# Altium schematic sheet PMIC.SchDoc: sparkfun-battery-babysitter
size 274 x 210 mm; Date: 9/29/2018 7:12:57 PM; SheetNumber: 1
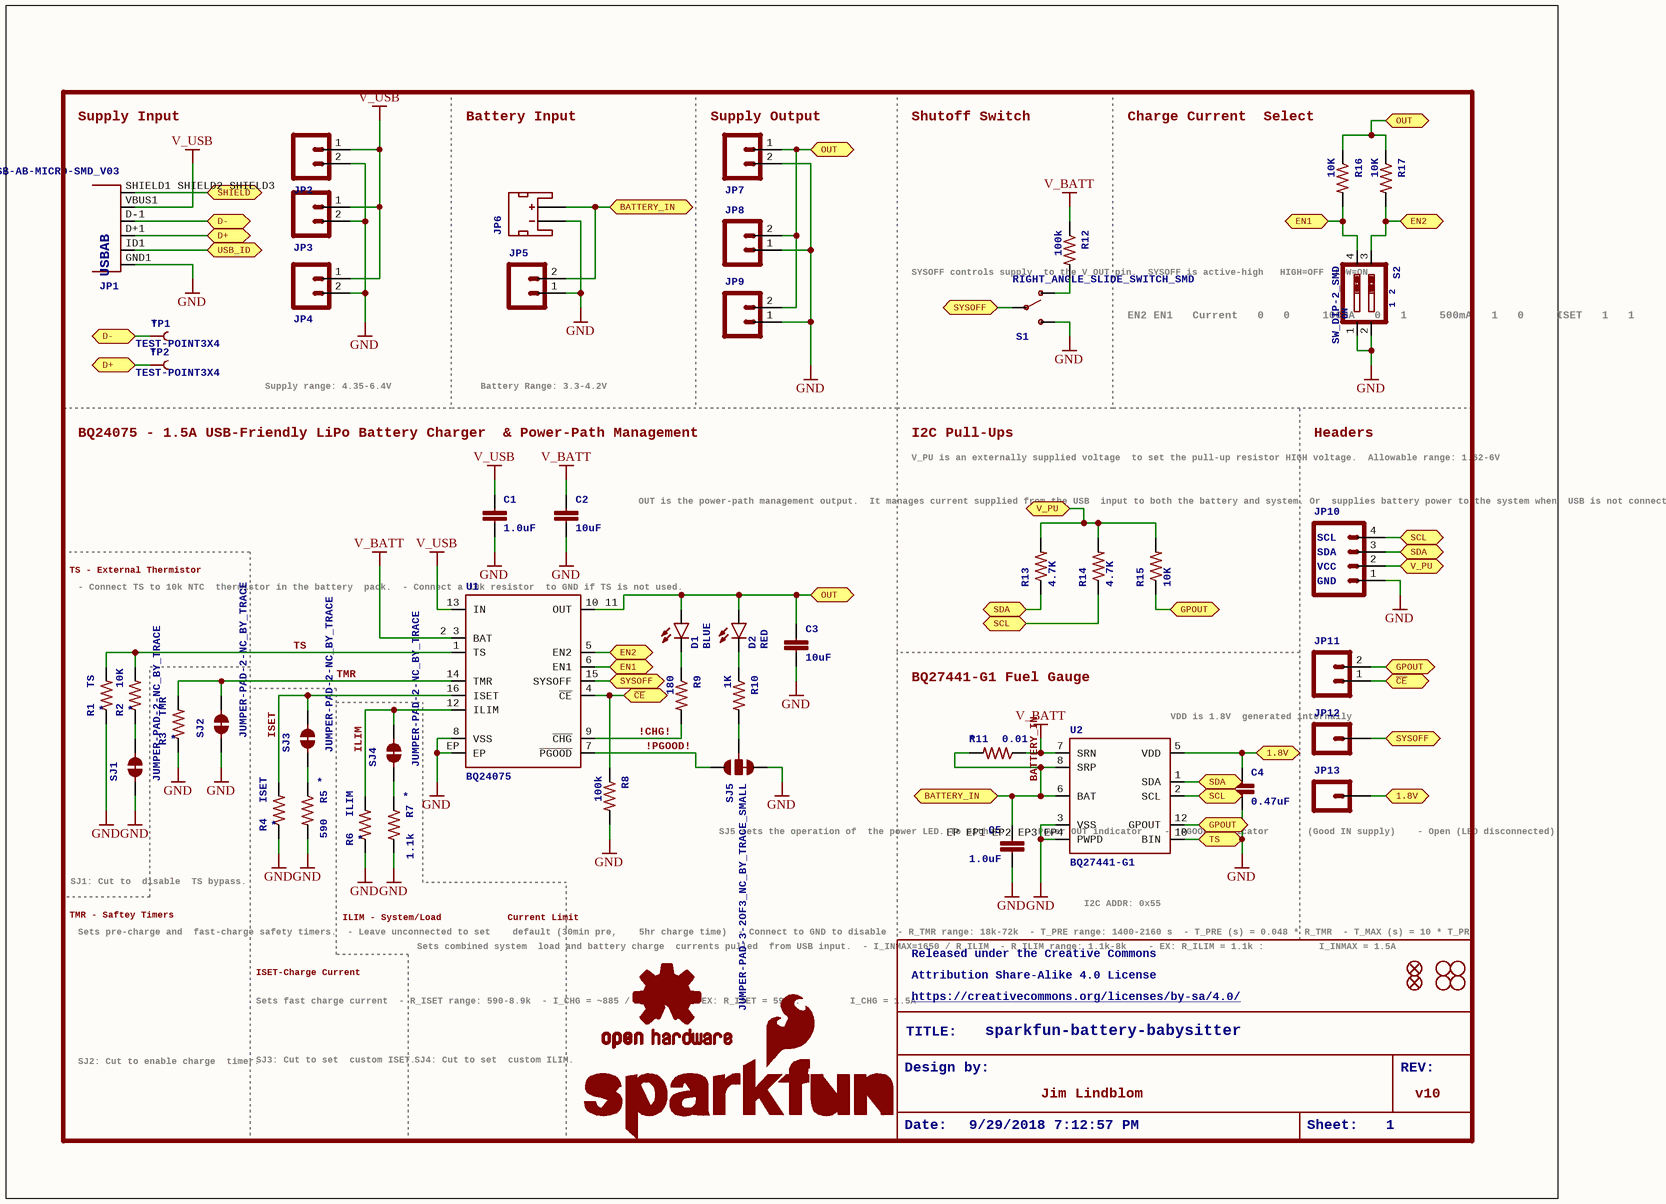
[diagram p0: PMIC.SchDoc]

## Parts
C1  1.0uF  [1206-CAP]
C2  10uF  [0805-CAP]
C3  10uF  [0805-CAP]
C4  0.47uF  [0603-CAP]
C5  1.0uF  [0603-CAP]
D1  BLUE  [LED-0603]
D2  RED  [LED-0603]
FID1  FIDUCIAL1X2  [FIDUCIAL-1X2]  (value not drawn)
FID2  FIDUCIAL1X2  [FIDUCIAL-1X2]  (value not drawn)
JP1  USB-AB-MICRO-SMD_V03  [USB-AB-MICRO-SMD_V03]
JP2  M021X02_NO_SILK  [1X02_NO_SILK]  (value not drawn)
JP3  M023.5MM-NO_SILK  [SCREWTERMINAL-3.5MM-2-NS]  (value not drawn)
JP4  M021X02_NO_SILK  [1X02_NO_SILK]  (value not drawn)
JP5  M021X02_NO_SILK  [1X02_NO_SILK]  (value not drawn)
JP6  JST_2MM_MALE  [JST-2-SMD]  (value not drawn)
JP7  M023.5MM-NO_SILK  [SCREWTERMINAL-3.5MM-2-NS]  (value not drawn)
JP8  M021X02_NO_SILK  [1X02_NO_SILK]  (value not drawn)
JP9  M02-JST-2-PTH-NO_SILK  [JST-2-PTH-NS]  (value not drawn)
JP10  I2C_STANDARD_NO_SILK  [1X04_NO_SILK]  (value not drawn)
JP11  M021X02_NO_SILK  [1X02_NO_SILK]  (value not drawn)
JP12  M01PTH_NO_SILK_YES_STOP  [1X01_NO_SILK]  (value not drawn)
JP13  M01PTH_NO_SILK_YES_STOP  [1X01_NO_SILK]  (value not drawn)
LOGO1  SFE_LOGO_NAME.1_INCH  [SFE_LOGO_NAME_.1]  (value not drawn)
LOGO2  SFE_LOGO_NAME_FLAME.1_INCH  [SFE_LOGO_NAME_FLAME_.1]  (value not drawn)
LOGO3  OSHW-LOGOS  [OSHW-LOGO-S]  (value not drawn)
R1  TS  [1/6W-RES]
R2  10K  [0603-RES]
R3  TMR  [1/6W-RES]
R4  ISET  [1/6W-RES]
R5  590  [0603-RES]
R6  ILIM  [1/6W-RES]
R7  1.1k  [0603-RES]
R8  100k  [0603-RES]
R9  180  [0603-RES]
R10  1K  [0603-RES]
R11  0.01  [1206]
R12  100k  [0603-RES]
R13  4.7K  [0603-RES]
R14  4.7K  [0603-RES]
R15  10K  [0603-RES]
R16  10K  [0603-RES]
R17  10K  [0603-RES]
S1  RIGHT_ANGLE_SLIDE_SWITCH_SMD  [SWITCH-SPST-SMD-A]
S2  SW_DIP-2_SMD  [DIPSWITCH-02-50MIL]
SJ1  JUMPER-PAD-2-NC_BY_TRACE  [PAD-JUMPER-2-NC_BY_TRACE_YES_SILK]
SJ2  JUMPER-PAD-2-NC_BY_TRACE  [PAD-JUMPER-2-NC_BY_TRACE_YES_SILK]
SJ3  JUMPER-PAD-2-NC_BY_TRACE  [PAD-JUMPER-2-NC_BY_TRACE_YES_SILK]
SJ4  JUMPER-PAD-2-NC_BY_TRACE  [PAD-JUMPER-2-NC_BY_TRACE_YES_SILK]
SJ5  JUMPER-PAD-3-2OF3_NC_BY_TRACE_SMALL  [PAD-JUMPER-3-2OF3_NC_BY_TRACE_YES_SILK_FULL_BOX]
STANDOFF1  STAND-OFF  [STAND-OFF]  (value not drawn)
STANDOFF2  STAND-OFF  [STAND-OFF]  (value not drawn)
STANDOFF3  STAND-OFF  [STAND-OFF]  (value not drawn)
STANDOFF4  STAND-OFF  [STAND-OFF]  (value not drawn)
TP1  TEST-POINT3X4  [PAD.03X.04]
TP2  TEST-POINT3X4  [PAD.03X.04]
U1  BQ24075  [PVQFN-N16]
U2  BQ27441-G1  [PDSO-N12]

## Ports
1.8V, BATTERY_IN, D+, D-, EN1, EN2, GPOUT, OUT, SCL, SDA, SHIELD, SYSOFF, TS, USB_ID, V_PU, ~{CE}

## Nets
GND: C1.2 C2.2 C3.2 C4.2 C5.2 JP1.GND1(GND) JP2.2 JP3.2 JP4.2 JP5.1 JP6.1(-) JP7.2 JP8.1 JP9.1 JP10.1 R1.1 R3.1 R4.1 R5.2 R6.1 R7.2 R8.2 S1.3(S) S2.1 S2.2 SJ1.1 SJ2.1 SJ5.3 U1.8(VSS) U1.EP U2.3(VSS) U2.10(BIN) U2.EP_EP1_EP2_EP3_EP4(PWPD) ; port TS
V_BATT: C2.1 R11.1 R12.1 U1.2_3(BAT) U2.7(SRN)
V_USB: C1.1 JP1.VBUS1(VBUS) JP2.1 JP3.1 JP4.1 U1.13(IN)
1.8V: C4.1 JP13.1 U2.5(VDD) ; port 1.8V
!CHG!: R9.2 U1.9(~{CHG})
!PGOOD!: SJ5.1 U1.7(~{PGOOD})
BATTERY_IN: C5.1 JP5.2 JP6.2(+) R11.2 U2.6(BAT) U2.8(SRP) ; port BATTERY_IN
~{CE}: JP11.1 R8.1 U1.4(~{CE}) ; port ~{CE}
D+: JP1.D+1(D+) TP2.P$1 ; port D+
D-: JP1.D-1(D-) TP1.P$1 ; port D-
EN1: R16.2 S2.4 U1.6(EN1) ; port EN1
EN2: R17.2 S2.3 U1.5(EN2) ; port EN2
GPOUT: JP11.2 R15.1 U2.12(GPOUT) ; port GPOUT
ILIM: R6.2 SJ4.2 U1.12(ILIM)
ISET: R4.2 SJ3.2 U1.16(ISET)
OUT: C3.1 D1.A D2.A JP7.1 JP8.2 JP9.2 R16.1 R17.1 U1.10_11(OUT) ; port OUT
SCL: JP10.4 R14.1 U2.2(SCL) ; port SCL
SDA: JP10.3 R13.1 U2.1(SDA) ; port SDA
SHIELD: JP1.SHIELD1_SHIELD2_SHIELD3(SHIELD) ; port SHIELD
SYSOFF: JP12.1 S1.2(P) U1.15(SYSOFF) ; port SYSOFF
TMR: R3.2 SJ2.2 U1.14(TMR)
TS: R1.2 R2.2 U1.1(TS)
USB_ID: JP1.ID1(USBID) ; port USB_ID
V_PU: JP10.2 R13.2 R14.2 R15.2 ; port V_PU
NetD1_C: D1.C R9.1
NetD2_C: D2.C R10.1
NetR2_1: R2.1 SJ1.2
NetR5_1: R5.1 SJ3.1
NetR7_1: R7.1 SJ4.1
NetR10_2: R10.2 SJ5.2
NetR12_2: R12.2 S1.1(O)

Not connected (* = marked no-connect by the designer): JP6 NC1(PAD1) NC2(PAD2)

## Notes on the sheet
- Supply Input
- Battery Input
- (near JP7) Supply Output
- Shutoff Switch
- Charge Current
  Select
- (near R12) SYSOFF controls supply
  to the V_OUT pin.
  SYSOFF is active-high
  HIGH=OFF
  LOW=ON
- (near S2) EN2 EN1   Current
  0   0     100mA
  0   1     500mA
  1   0     ISET
  1   1     Standby
- BQ24075 - 1.5A USB-Friendly LiPo Battery Charger
  & Power-Path Management
- Supply range: 4.35-6.4V
- Battery Range: 3.3-4.2V
- I2C Pull-Ups
- Headers
- OUT is the power-path management output.
  It manages current supplied from the USB
  input to both the battery and system. Or
  supplies battery power to the system when
  USB is not connected.
  OUT supply w/ USB: V_USB - 0.3V
  OUT supply w/o USB: V_BAT - 0.05V
- V_PU is an externally supplied voltage
  to set the pull-up resistor HIGH voltage.
  Allowable range: 1.62-6V
- TS - External Thermistor
- (near U1) - Connect TS to 10k NTC
  thermistor in the battery
  pack.
  - Connect a 10k resistor
  to GND if TS is not used.
- BQ27441-G1 Fuel Gauge
- VDD is 1.8V
  generated internally
- SJ5 sets the operation of
  the power LED. To either:
  - Power OUT indicator
  - !PGOOD! indicator
  (Good IN supply)
  - Open (LED disconnected)
- TMR - Saftey Timers
- SJ1: Cut to
  disable
  TS bypass.
- Sets pre-charge and
  fast-charge safety timers.
  - Leave unconnected to set
  default (30min pre,
  5hr charge time)
  - Connect to GND to disable
  - R_TMR range: 18k-72k
  - T_PRE range: 1400-2160 s
  - T_PRE (s) = 0.048 * R_TMR
  - T_MAX (s) = 10 * T_PRE
- ILIM - System/Load
  Current Limit
- (near LOGO3) Sets combined system
  load and battery charge
  currents pulled
  from USB input.
  - I_INMAX=1650 / R_ILIM
  - R_ILIM range: 1.1k-8k
  - EX: R_ILIM = 1.1k :
  I_INMAX = 1.5A
- I2C ADDR: 0x55
- (near LOGO3) Sets fast charge current
  - R_ISET range: 590-8.9k
  - I_CHG = ~885 / R_ISET
  - EX: R_ISET = 590 :
  I_CHG = 1.5A
- ISET-Charge Current
- Released under the Creative Commons
- Attribution Share-Alike 4.0 License
- https://creativecommons.org/licenses/by-sa/4.0/
- SJ2: Cut to enable charge
  timer.
- SJ3: Cut to set
  custom ISET.
- SJ4: Cut to set
  custom ILIM.
- Design by:
- TITLE:
- sparkfun-battery-babysitter
- Jim Lindblom
- REV:
- v10
- Date:
- 9/29/2018 7:12:57 PM
- Sheet:
- 1

## Library data of the parts
C1 = 1.0UF50V10%(1206): CAP-09822; PROD_ID: CAP-09822
C2 C3 = 10UF10V10%(0805): CAP-11330; PROD_ID: CAP-11330
C4 = CAP0603-CAP: CapacitorStandard 0603 ceramic capacitor, and 0.1" leaded capacitor.; PROD_ID: *
C5 = 1.0UF-16V-10%(0603): CAP-00868; PROD_ID: CAP-00868
D1 = LED-BLUE0603: Blue LEDs for production use    Various blue LEDs stocked by SparkFun production 0603 - DIO-08575 Rebel - DIO-09553 1206 - DIO-09911; PROD_ID: DIO-08575
D2 = LED-RED0603: Assorted Red LEDs LilyPad 1206- DIO-09912 1206- DIO-00809 0603- DIO-00819 "SMART" means more efficient and expensive; PROD_ID: DIO-00819
FID1 FID2 = FIDUCIAL1X2: Fiducial Alignment PointsVarious fiducial points for machine vision alignment.
JP1 = USB-ABCONN-11794: This is a USB AB connector that is compatible with USB OTG. i.e. this connector can serve as a host or device; PROD_ID: CONN-11794; USBAB: USBAB
JP2 JP4 JP5 JP8 JP11 = M021X02_NO_SILK: Standard 2-pin 0.1" header. Use with  - straight break away headers ( PRT-00116) - right angle break away headers (PRT-00553) - swiss pins (PRT-00743) - machine pins (PRT-00117) - female headers (PRT-00115)   Molex polarized connector foot print use with: PRT-08233 with associated crimp pins and housings.  2.54_SCREWTERM for use with  PRT-10571.  3.5mm Screw Terminal footprints for  PRT-08084  5mm Screw Terminal footprints for use with PRT-08432
JP3 JP7 = M023.5MM-NO_SILK: Standard 2-pin 0.1" header. Use with  - straight break away headers ( PRT-00116) - right angle break away headers (PRT-00553) - swiss pins (PRT-00743) - machine pins (PRT-00117) - female headers (PRT-00115)   Molex polarized connector foot print use with: PRT-08233 with associated crimp pins and housings.  2.54_SCREWTERM for use with  PRT-10571.  3.5mm Screw Terminal footprints for  PRT-08084  5mm Screw Terminal footprints for use with PRT-08432; PROD_ID: CONN-08399
JP6 = JST_2MM_MALE: Mates to single-cell LiPo batteries. CONN-11443 Now with smashable polarity marks!; BTM_POS: +; BTM_NEG: -; PROD_ID: CONN-11443; TOP_NEG: -; TOP_POS: +
JP9 = M02-JST-2-PTH-NO_SILK: Standard 2-pin 0.1" header. Use with  - straight break away headers ( PRT-00116) - right angle break away headers (PRT-00553) - swiss pins (PRT-00743) - machine pins (PRT-00117) - female headers (PRT-00115)   Molex polarized connector foot print use with: PRT-08233 with associated crimp pins and housings.  2.54_SCREWTERM for use with  PRT-10571.  3.5mm Screw Terminal footprints for  PRT-08084  5mm Screw Terminal footprints for use with PRT-08432
JP10 = I2C_STANDARD_NO_SILK: SparkFun has standardized on a pinout for all I2C based sensor breakouts.  This pinout allows I2C boards to be plugged directly into the headers on Arduino Uno compatible boards, and to be daisy chained easily.; SDA: SDA; VCC: VCC; GND: GND; SCL: SCL
JP12 JP13 = M01PTH_NO_SILK_YES_STOP: Header 1Standard 1-pin 0.1" header. Use with straight break away headers (SKU : PRT-00116), right angle break away headers (PRT-00553), swiss pins (PRT-00743), machine pins (PRT-00117), and female headers (PRT-00115). SMTSO-256-ET is a "flush mount" nut for a 4-40 screw. The older package used to be too tight, and did not allow it to sit properly thru the drill hit. The latest (0.165DIA) fits nice and snug.
LOGO1 = SFE_LOGO_NAME.1_INCH: SFE Logo, name only    This is the SparkFun name logo. The logo on the schematic will always be the same size; the package variant is the height of the flame part of the logo (or the height the flame would be, if it were drawn). Default layer for the logo on the board is tSilk.
LOGO2 = SFE_LOGO_NAME_FLAME.1_INCH: SFE Logo, name and flame    This is the SparkFun full logo. The logo on the schematic will always be the same size; the package variant is the height of the flame part of the logo. Default layer for the logo on the board is tSilk.
LOGO3 = OSHW-LOGOS: Open Source Hardware Logo This logo indicates the piece of hardware it is found on incorporates a OSHW license and/or adheres to the definition of open source hardware found here: http://freedomdefined.org/OSHW
R1 R3 R4 R6 = RESISTORPTH-1/6W: ResistorBasic schematic elements and footprints for 0603, 1206, and PTH resistors.; NAME: *
R2 R15-R17 = 10KOHM-1/10W-1%(0603)0603: RES-00824; PROD_ID: RES-00824
  R2: NAME: *
R5 R7 = RESISTOR0603-RES: ResistorBasic schematic elements and footprints for 0603, 1206, and PTH resistors.; NAME: *; PROD_ID: *
R8 R12 = 100KOHM-1/10W-1%(0603): RES-07828; PROD_ID: RES-07828
R9 = 180OHM1/10W1%(0603): RES-08788; PROD_ID: RES-08788
R10 = 1KOHM-1/10W-1%(0603): RES-07856; PROD_ID: RES-07856
R11 = RESISTOR1206: ResistorBasic schematic elements and footprints for 0603, 1206, and PTH resistors.; NAME: *; PROD_ID: *
R13 R14 = 4.7KOHM-1/10W-1%(0603): RES-07857; PROD_ID: RES-07857
S1 = SWITCH-SPDT-SMD-A: SPDT Switch Simple slide switch, Spark Fun Electronics SKU : COM-00102 DPDT SMT slide switch, AYZ0202, SWCH-08179; PROD_ID: SWCH-10651
S2 = SW_DIP-2-SMT-HALFSIZE: DIP SWITCH; PROD_ID: *; 1: 1; 2: 2; ON: ON
STANDOFF1-STANDOFF4 = STAND-OFF: #4 Stand Off   This is the mechanical footprint for a #4 phillips button head screw. Use the keepout ring to avoid running the screw head into surrounding components. SKU : PRT-00447
TP1 TP2 = TEST-POINT3X4: Bare copper test points for troubleshooting or ICT; NAME: *
U1 = BQ24075: Texas Instruments BQ24075 LiPo Battery Chargerand Power-Path Management IC    The bq2407x series of devices are integrated Li-Ion linear chargers and system power path management devices targeted at space-limited portable applications. The devices operate from either a USB port or an AC adapter and support charge currents up to 1.5 A. The input voltage range with input overvoltage protection supports unregulated adapters. The USB input current limit accuracy and start up sequence allow the bq2407x to meet USB-IF inrush current specifications. Additionally, the input dynamic power management (VIN-DPM) prevents the charger from crashing incorrectly configured USB sources.   Datasheet SparkFun Products  SparkFun Battery Babysitter (PRT-13777); PROD_ID: *
U2 = BQ27441-G1: Texas Instruments BQ27441-G1 LiPo Battery Fuel Gauge    The Texas Instruments bq27441-G1 fuel gauge is a microcontroller peripheral that provides system-side fuel gauging for single-cell Li-Ion batteries. The device requires minimal user configuration and system microcontroller firmware development.   The bq27441-G1 battery fuel gauge uses the patented Impedance Trackâ„¢ algorithm for fuel gauging, and provides information such as remaining battery capacity (mAh), state-of-charge (%), and battery voltage (mV).   Datasheet SparkFun Products  SparkFun Battery Babysitter (PRT-13777); PROD_ID: *